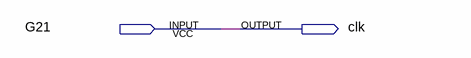
[diagram p0: schematic sheet]
// Quartus schematic Clock.bdf as structural Verilog: 0 symbols, 2 pins
module Clock (
  input  G21,
  output clk
);


  assign clk = G21;
endmodule
